# EAGLE design sw8 (EAGLE 9.6.2)
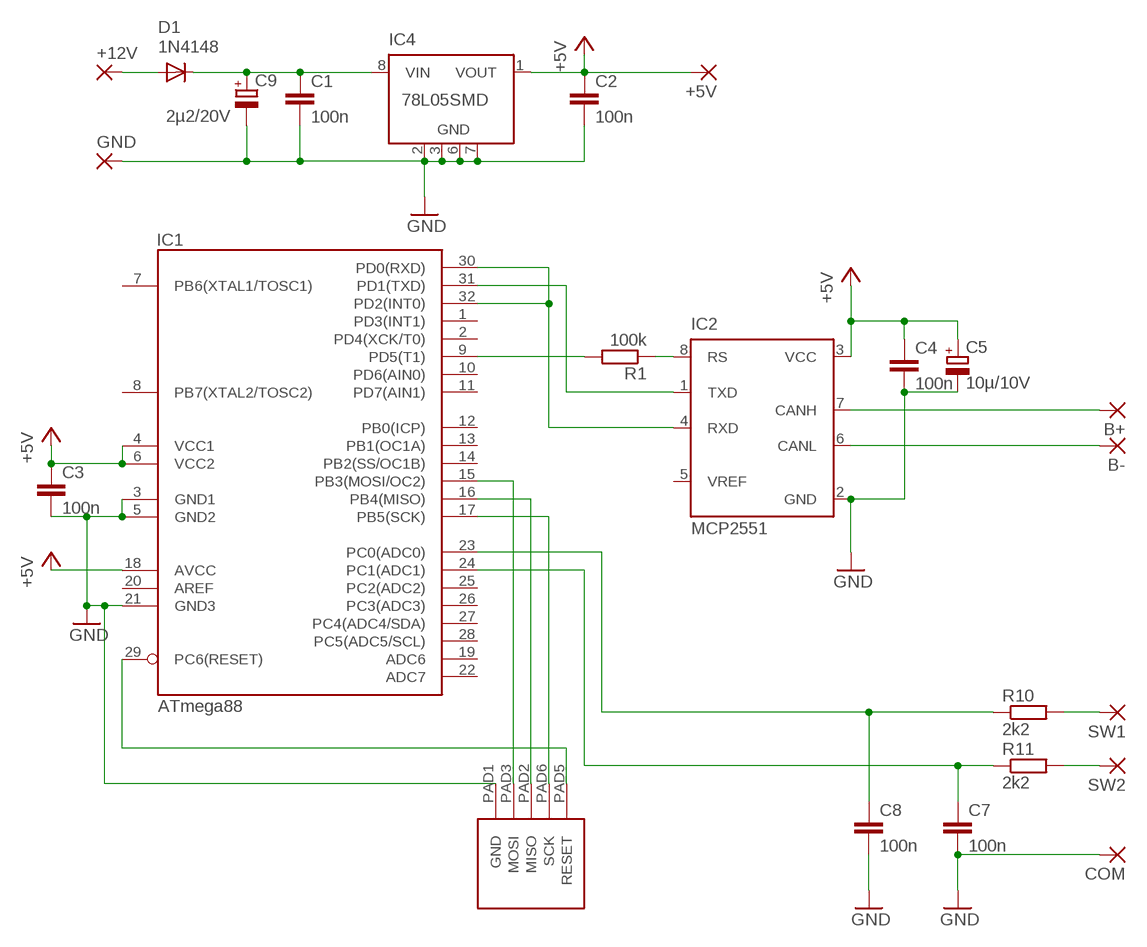
[diagram p0: schematic, sheet 1]

## Parts
+5V  1,6/0,8  [1,6/0,8]
+12V  1,6/0,8  [1,6/0,8]
B+  1,6/0,8  [1,6/0,8]
B-  1,6/0,8  [1,6/0,8]
C1  100n  C-EUC0603  [C0603]
C2  100n  C-EUC0603  [C0603]
C3  100n  C-EUC0603  [C0603]
C4  100n  C-EUC0603  [C0603]
C5  10µ/10V  CPOL-EUA/3216-18W  [A/3216-18W]
C7  100n  C-EUC0603  [C0603]
C8  100n  C-EUC0603  [C0603]
C9  2µ2/20V  CPOL-EUA/3216-18W  [A/3216-18W]
COM  1,6/0,8  [1,6/0,8]
D1  1N4148  DIODE-SOD80C  [SOD80C]
GND  1,6/0,8  [1,6/0,8]
IC1  ATmega88  ATMEGA8  [TQFP32-08]
IC2  MCP2551  PCA82C250SMD  [SO8]
IC4  78L05SMD  [SO08]
R1  100k  R-EU_R0603  [R0603]
R10  2k2  R-EU_R0603  [R0603]
R11  2k2  R-EU_R0603  [R0603]
SW1  1,6/0,8  [1,6/0,8]
SW2  1,6/0,8  [1,6/0,8]
U$1  ATMEL_ISP  [ATMEL_ISP]

## Nets
+5V: +5V.1(P) C2.1 C3.1 C4.1 C5.+ IC1.4(VCC1) IC1.6(VCC2) IC1.18(AVCC) IC2.3(VCC) IC4.1(VOUT)
GND: C1.2 C2.2 C3.2 C4.2 C5.- C7.2 C8.2 C9.- COM.1(P) GND.1(P) IC1.3(GND1) IC1.5(GND2) IC1.21(GND3) IC2.2(GND) IC4.2(GND) IC4.3(GND) IC4.6(GND) IC4.7(GND) U$1.PAD1(GND)
MISO: IC1.16(PB4(MISO)) U$1.PAD2(MISO)
MOSI: IC1.15(PB3(MOSI/OC2)) U$1.PAD3(MOSI)
N$1: B+.1(P) IC2.7(CANH)
N$2: B-.1(P) IC2.6(CANL)
N$3: IC1.31(PD1(TXD)) IC2.1(TXD)
N$4: IC1.30(PD0(RXD)) IC1.32(PD2(INT0)) IC2.4(RXD)
N$5: IC2.8(RS) R1.1
N$6: IC1.9(PD5(T1)) R1.2
N$13: C1.1 C9.+ D1.C IC4.8(VIN)
N$15: C7.1 IC1.24(PC1(ADC1)) R11.1
N$16: C8.1 IC1.23(PC0(ADC0)) R10.1
N$19: +12V.1(P) D1.A
N$23: R10.2 SW1.1(P)
N$24: R11.2 SW2.1(P)
RESET: IC1.29(PC6(RESET)) U$1.PAD5(RESET)
SCK: IC1.17(PB5(SCK)) U$1.PAD6(SCK)
Unconnected: IC1.1(PD3(INT1)) IC1.2(PD4(XCK/T0)) IC1.7(PB6(XTAL1/TOSC1)) IC1.8(PB7(XTAL2/TOSC2)) IC1.10(PD6(AIN0)) IC1.11(PD7(AIN1)) IC1.12(PB0(ICP)) IC1.13(PB1(OC1A)) IC1.14(PB2(SS/OC1B)) IC1.19(ADC6) IC1.22(ADC7) IC1.25(PC2(ADC2)) IC1.26(PC3(ADC3)) IC1.27(PC4(ADC4/SDA)) IC1.28(PC5(ADC5/SCL)) IC2.5(VREF) IC4.4(NC) IC4.5(NC)

## Power pins joined to a net without a drawn wire
AREF: IC1.20(AREF)

## Library data of the parts
+5V +12V B+ B- COM GND SW1 SW2 = wirepad:1,6/0,8: THROUGH-HOLE PAD
C1-C4 C7 C8 = rcl:C-EU: CAPACITOR, European symbol
C5 C9 = rcl:CPOL-EU: POLARIZED CAPACITOR, European symbol
D1 = diode:DIODE-: DIODE
IC1 = mylib:ATMEGA8: 8-bit AVR with 8K Bytes In-System Programmable Flash
IC2 = mylib:PCA82C250: CAN CONTROLLER INTERFACE
IC4 = linear:78L*SMD: Positive VOLTAGE REGULATOR
R1 R10 R11 = rcl:R-EU_: RESISTOR, European symbol
U$1 = mylib:ATMEL_ISP

## Board
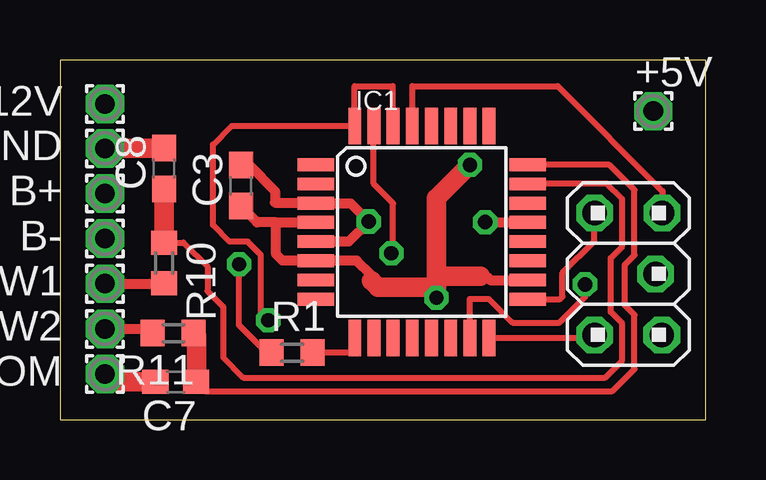
[diagram p1: board, top side]
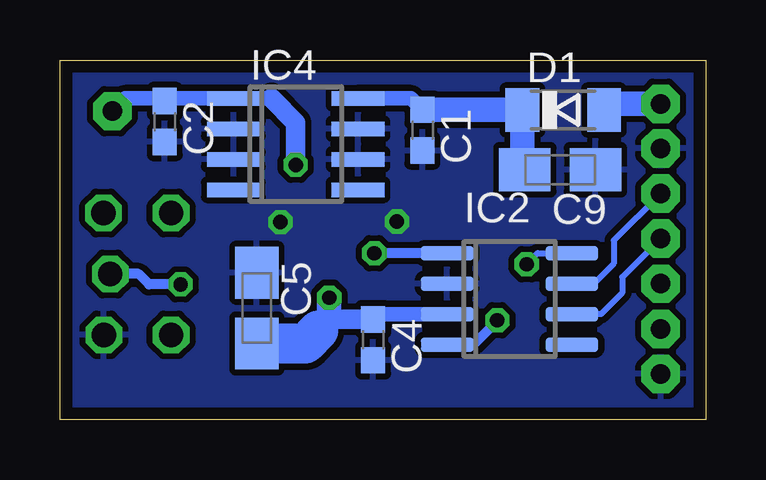
[diagram p2: board, bottom side, seen from below]

Size 26.92 x 14.99 mm. Coordinates in mm from the lower left corner, seen from the top.
Outline: 0,0 26.92,0 26.92,14.99 0,14.99 0,0
Copper layers (1*16): Top 0.035mm / dielectric 1.5mm / Bottom 0.035mm
Design rules "Bilex DRU": minimum track width 10mil, minimum drill 24mil, track to track 10mil, track to pad 10mil, pad to pad 10mil, via to via 10mil, smd to smd 10mil, copper to edge 20mil, drill to drill 8mil, minimum pad ring 10mil, minimum via ring 8mil, stop-mask expansion 4mil, vias tented up to drill 24mil, thermal gap 10mil

### Footprints (pad centres in the part's own frame; a part is rotated, then mirrored left to right if it is on the bottom)
1,6/0,8 = drill 0.813 pad 1.6 octagon: 1 0,0
C0603 = smd 1.1 x 1: 1 -0.85,0; 2 0.85,0
A/3216-18W = smd 2.15 x 1.8: + 1.475,0; - -1.475,0
SOD80C = smd 1.4 x 1.8: A 1.7,0; C -1.7,0
TQFP32-08 = smd 1.524 x 0.533: 1 -4.42,2.8; 2 -4.42,2; 3 -4.42,1.2; 4 -4.42,0.4; 5 -4.42,-0.4; 6 -4.42,-1.2; 7 -4.42,-2; 8 -4.42,-2.8; 17 4.42,-2.8; 18 4.42,-2; 19 4.42,-1.2; 20 4.42,-0.4; 21 4.42,0.4; 22 4.42,1.2; 23 4.42,2; 24 4.42,2.8 | smd 0.533 x 1.524: 9 -2.8,-4.42; 10 -2,-4.42; 11 -1.2,-4.42; 12 -0.4,-4.42; 13 0.4,-4.42; 14 1.2,-4.42; 15 2,-4.42; 16 2.8,-4.42; 25 2.8,4.42; 26 2,4.42; 27 1.2,4.42; 28 0.4,4.42; 29 -0.4,4.42; 30 -1.2,4.42; 31 -2,4.42; 32 -2.8,4.42
SO8 = smd 0.6 x 2.2: 1 -1.905,-2.6; 2 -0.635,-2.6; 3 0.635,-2.6; 4 1.905,-2.6; 5 1.905,2.6; 6 0.635,2.6; 7 -0.635,2.6; 8 -1.905,2.6
SO08 = smd 0.6 x 2.2: 1 -1.905,-2.6; 2 -0.635,-2.6; 3 0.635,-2.6; 4 1.905,-2.6; 5 1.905,2.6; 6 0.635,2.6; 7 -0.635,2.6; 8 -1.905,2.6
R0603 = smd 1 x 1.1: 1 -0.85,0; 2 0.85,0
ATMEL_ISP = drill 1.016 octagon: PAD1 1.397,-2.54; PAD2 -1.41,-2.54; PAD3 1.13,0; PAD5 1.41,2.54; PAD6 -1.41,2.54

### Placement (x,y rotation side)
+5V  24.74,12.85 0 top
+12V  1.88,13.16 0 top
B+  1.88,9.42 0 top
B-  1.88,7.54 0 top
C1  11.81,12.06 270 bottom
C2  22.56,12.42 270 bottom
C3  7.54,9.75 90 top
C4  13.87,3.33 270 bottom
C5  18.72,4.65 270 bottom
C7  4.83,1.57 180 top
C8  4.34,10.46 90 top
C9  6.07,10.41 180 bottom
COM  1.88,1.91 0 top
D1  5.94,12.9 0 bottom
GND  1.88,11.3 0 top
IC1  15.09,7.82 0 top
IC2  8.18,5.03 270 bottom
IC4  17.09,11.48 270 bottom
R1  9.68,2.79 0 top
R10  4.34,6.53 270 top
R11  4.72,3.61 180 top
SW1  1.88,5.66 0 top
SW2  1.88,3.78 0 top
U$1  23.7,6.07 0 top

### Tracks (layer width: path | path; a pad name or v marks a point on that pad's centre or on a via)
+5V  (via drill 0.6)
  Top 0.406: IC1.4 9.02,8.22 | IC1.18 17.93,5.82 17.78,5.97 17.53,5.97 | C3.1 8.21,8.22 9.02,8.22 | 9.02,8.22 9.02,6.88 9.28,6.62 IC1.6 12.37,6.63 12.98,6.02 12.98,5.79
  Top 0.813: 12.98,5.79 13.26,5.51 15.7,5.51 v15.7,5.08 15.7,5.97 | v17.09,10.62 15.7,9.22 15.7,5.97 | 15.7,5.97 17.53,5.97
  Bottom 0.61: 18.11,13.39 IC4.1 | 19.71,13.39 IC4.1 | IC4.1 22.44,13.39 C2.1 22.58,13.3 22.58,13.39 24.21,13.39 +5V.1 | C4.1 13.65,4.39 IC2.3
  Bottom 0.813: v17.09,10.62 17.09,12.37 18.11,13.39 | 15.7,4.22 15.67,4.22 15.63,4.18 C4.1
  Bottom 1.016: v15.7,5.08 15.7,4.22 15.7,4.17 15.67,4.17 16.13,3.71 16.15,3.71
  Bottom 1.676: C5.+ 16.69,3.17 16.15,3.71
GND  (via drill 0.6, 0.6 pad 0.25)
  Top 0.406: IC1.5 12.04,7.42 v12.88,8.26 12.12,9.02 IC1.3 10.65,9.04 8.97,9.04 8.97,9.53 7.9,10.59 C3.2 | IC1.21 v17.73,8.23
  Top 0.813: C8.2 GND.1 | C7.2 2.21,1.57 COM.1
  pour Bottom: 0.13,14.86 0.13,0.15 26.77,0.15 26.77,14.86
MISO
  Top 0.254: U$1.PAD2 22.17,3.4 IC1.16
MOSI  (via drill 0.6)
  Top 0.254: IC1.15 17.09,5.03 17.88,5.03 18.87,4.04 20.83,4.04 21.89,5.11 v21.89,5.64
  Bottom 0.406: v21.89,5.64 23.22,5.64 23.65,6.07 U$1.PAD3 24.84,6.07
N$1
  Bottom 0.254: IC2.7 4.67,5.66 3.83,6.5 3.83,7.47 B+.1
N$2
  Bottom 0.254: IC2.6 4.37,4.39 3.48,5.28 3.48,5.94 B-.1
N$3  (via drill 0.6)
  Top 0.254: IC1.31 13.08,9.83 13.89,9.02 13.89,7.04 13.82,6.96 v13.82,6.93
  Bottom 0.406: IC2.1 v13.82,6.93
N$4  (via drill 0.6)
  Top 0.254: IC1.30 13.87,12.24 13.87,13.89 12.29,13.89 IC1.32 | v8.69,4.14 8.38,4.45 8.38,6.86 7.82,7.42 7.06,7.42 6.38,8.1 6.38,11.46 7.16,12.24 IC1.32 | IC1.32
  Bottom 0.406: v8.69,4.14 8.66,4.14 9.68,3.12 IC2.4
N$5  (via drill 0.6 pad 0.25)
  Top 0.254: v7.47,6.48 7.47,3.94 8.61,2.79 R1.1
  Bottom 0.254: IC2.8 7.01,6.93 v7.47,6.48
N$6
  Top 0.254: 12.27,3.4 12.22,3.45 | R1.2 12.09,2.79 12.27,2.97 12.27,3.4 | IC1.9 12.27,3.4
N$13
  Bottom 0.61: 14.53,13.39 IC4.8 12.28,13.39 C1.1
  Bottom 1.016: C9.+ 7.64,10.51 D1.C C1.1
N$15
  Top 0.254: IC1.24 19.49,10.62 19.48,10.62 22.91,10.62 23.95,9.58 23.95,6.86 23.55,6.45 23.55,4.78 23.95,4.37 23.95,2.11 23.04,1.19 6.06,1.19 C7.1
  Top 0.813: C7.1 5.69,3.49 R11.1
N$16
  Top 0.254: IC1.23 | R10.1 5.14,7.38 6.15,6.38 6.15,5.36 6.81,4.7 6.81,2.59 7.64,1.75 22.73,1.75 23.44,2.46 23.44,4.01 22.96,4.5 22.96,6.73 23.44,7.21 23.44,9.2 22.81,9.83 IC1.23 | IC1.23 19.48,9.83
  Top 0.813: R10.1 C8.1
N$19
  Bottom 1.016: D1.A 3.99,13.16 +12V.1
N$23
  Top 0.406: R10.2 4.36,5.68 4.37,5.66 SW1.1
N$24
  Top 0.406: 3.87,3.59 3.89,3.58 | 3.87,3.59 R11.2 | SW2.1 3.68,3.79 3.87,3.59
RESET
  Top 0.254: IC1.29 14.69,13.89 20.75,13.89 25.12,9.53 U$1.PAD5
SCK
  Top 0.254: IC1.17 20.85,5.02 20.95,5.13 20.95,6.12 22.28,7.44 22.28,8.61 U$1.PAD6